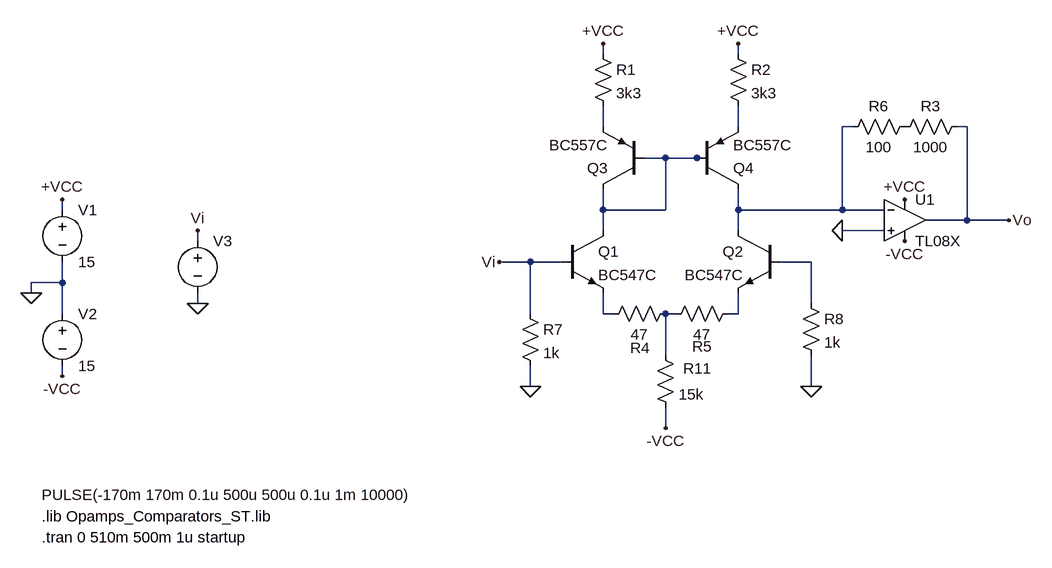
[diagram p0: schematic CrazyStuff_v3.asc]
CrazyStuff_v3.asc, the LTspice schematic file:
Version 4
SHEET 1 1136 1032
WIRE 464 -224 464 -240
WIRE 672 -224 672 -240
WIRE 464 -112 464 -144
WIRE 672 -112 672 -144
WIRE 848 -112 832 -112
WIRE 1024 -112 1008 -112
WIRE 560 -64 528 -64
WIRE 608 -64 560 -64
WIRE 624 -64 608 -64
WIRE -368 16 -368 0
WIRE 464 16 464 -16
WIRE 560 16 560 -64
WIRE 560 16 464 16
WIRE 672 16 672 -16
WIRE 832 16 832 -112
WIRE 832 16 672 16
WIRE 896 16 832 16
WIRE 1024 32 1024 -112
WIRE 1024 32 960 32
WIRE 1088 32 1024 32
WIRE 464 48 464 16
WIRE 672 48 672 16
WIRE 896 48 832 48
WIRE -160 64 -160 48
WIRE 352 96 304 96
WIRE 400 96 352 96
WIRE 784 96 736 96
WIRE -368 128 -368 96
WIRE -368 128 -416 128
WIRE -416 144 -416 128
WIRE -160 160 -160 144
WIRE 784 160 784 96
WIRE -368 176 -368 128
WIRE 352 176 352 96
WIRE 464 176 464 144
WIRE 480 176 464 176
WIRE 576 176 560 176
WIRE 672 176 672 144
WIRE 672 176 656 176
WIRE 560 240 560 176
WIRE -368 272 -368 256
WIRE 352 288 352 256
WIRE 784 288 784 240
WIRE 560 352 560 320
FLAG -416 144 0
FLAG -368 0 +VCC
FLAG -368 272 -VCC
FLAG -160 160 0
FLAG -160 48 Vi
FLAG 672 -240 +VCC
FLAG 464 -240 +VCC
FLAG 928 0 +VCC
FLAG 928 64 -VCC
FLAG 1088 32 Vo
FLAG 352 288 0
FLAG 832 48 0
FLAG 560 352 -VCC
FLAG 784 288 0
FLAG 304 96 Vi
SYMBOL voltage -368 0 R0
WINDOW 123 0 0 Left 0
WINDOW 39 0 0 Left 0
SYMATTR InstName V1
SYMATTR Value 15
SYMBOL voltage -368 160 R0
WINDOW 123 0 0 Left 0
WINDOW 39 0 0 Left 0
SYMATTR InstName V2
SYMATTR Value 15
SYMBOL voltage -160 48 R0
WINDOW 3 -240 407 Left 2
WINDOW 123 0 0 Left 0
WINDOW 39 0 0 Left 0
SYMATTR Value PULSE(-170m 170m 0.1u 500u 500u 0.1u 1m 10000)
SYMATTR InstName V3
SYMBOL npn 400 48 R0
SYMATTR InstName Q1
SYMATTR Value BC547C
SYMBOL npn 736 48 M0
SYMATTR InstName Q2
SYMATTR Value BC547C
SYMBOL res 448 -240 R0
SYMATTR InstName R1
SYMATTR Value 3k3
SYMBOL res 656 -240 R0
SYMATTR InstName R2
SYMATTR Value 3k3
SYMBOL Opamps\\opamp2 928 -32 R0
SYMATTR InstName U1
SYMATTR Value TL08X
SYMBOL res 1024 -128 R90
WINDOW 0 0 56 VBottom 2
WINDOW 3 32 56 VTop 2
SYMATTR InstName R3
SYMATTR Value 1000
SYMBOL res 576 160 R90
WINDOW 0 84 55 VBottom 2
WINDOW 3 32 56 VTop 2
SYMATTR InstName R4
SYMATTR Value 47
SYMBOL res 672 160 R90
WINDOW 0 82 56 VBottom 2
WINDOW 3 32 56 VTop 2
SYMATTR InstName R5
SYMATTR Value 47
SYMBOL res 944 -128 R90
WINDOW 0 0 56 VBottom 2
WINDOW 3 32 56 VTop 2
SYMATTR InstName R6
SYMATTR Value 100
SYMBOL res 336 160 R0
SYMATTR InstName R7
SYMATTR Value 1k
SYMBOL pnp 528 -16 R180
SYMATTR InstName Q3
SYMATTR Value BC557C
SYMBOL pnp 608 -16 M180
SYMATTR InstName Q4
SYMATTR Value BC557C
SYMBOL res 544 224 R0
WINDOW 0 43 36 Left 2
SYMATTR InstName R11
SYMATTR Value 15k
SYMBOL res 768 144 R0
SYMATTR InstName R8
SYMATTR Value 1k
TEXT -400 520 Left 2 !.tran 0 510m 500m 1u startup
TEXT -400 488 Left 2 !.lib Opamps_Comparators_ST.lib

The netlist it stands for:
* CrazyStuff_v3.asc
V1 +VCC 0 15
V2 0 -VCC 15
V3 Vi 0 PULSE(-170m 170m 0.1u 500u 500u 0.1u 1m 10000)
Q1 N004 Vi N006 0 BC547C
Q2 N003 N005 N008 0 BC547C
R1 +VCC N001 3k3
R2 +VCC N002 3k3
XU1 0 N003 +VCC -VCC Vo TL08X  ; pins In+ In- V+ V- OUT
R3 Vo P001 1000
R4 N007 N006 47
R5 N008 N007 47
R6 P001 N003 100
R7 Vi 0 1k
Q3 N004 N004 N001 0 BC557C
Q4 N003 N004 N002 0 BC557C
R11 N007 -VCC 15k
R8 N005 0 1k
.model NPN NPN
.model PNP PNP
.lib standard.bjt
.tran 0 510m 500m 1u startup
.lib Opamps_Comparators_ST.lib
.backanno
.end

* Results of the author's LTspice run, read from the files saved beside the schematic
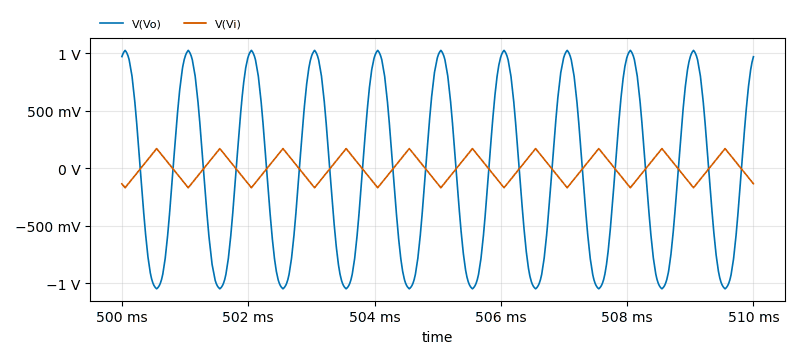
[diagram p1: Transient Analysis of CrazyStuff_v3.asc, plotted from the saved traces]
* Transient Analysis, 1 run:
*   V(Vo): min -1.048 V, max 1.023 V, average -45.93 mV, rms 753.9 mV, last 967.3 mV
*   V(Vi): min -170 mV, max 170 mV, average 30.56 µV, rms 98.48 mV, last -135.3 mV